# EAGLE design ardunio-physics-board-v1 (EAGLE 9.6.2)
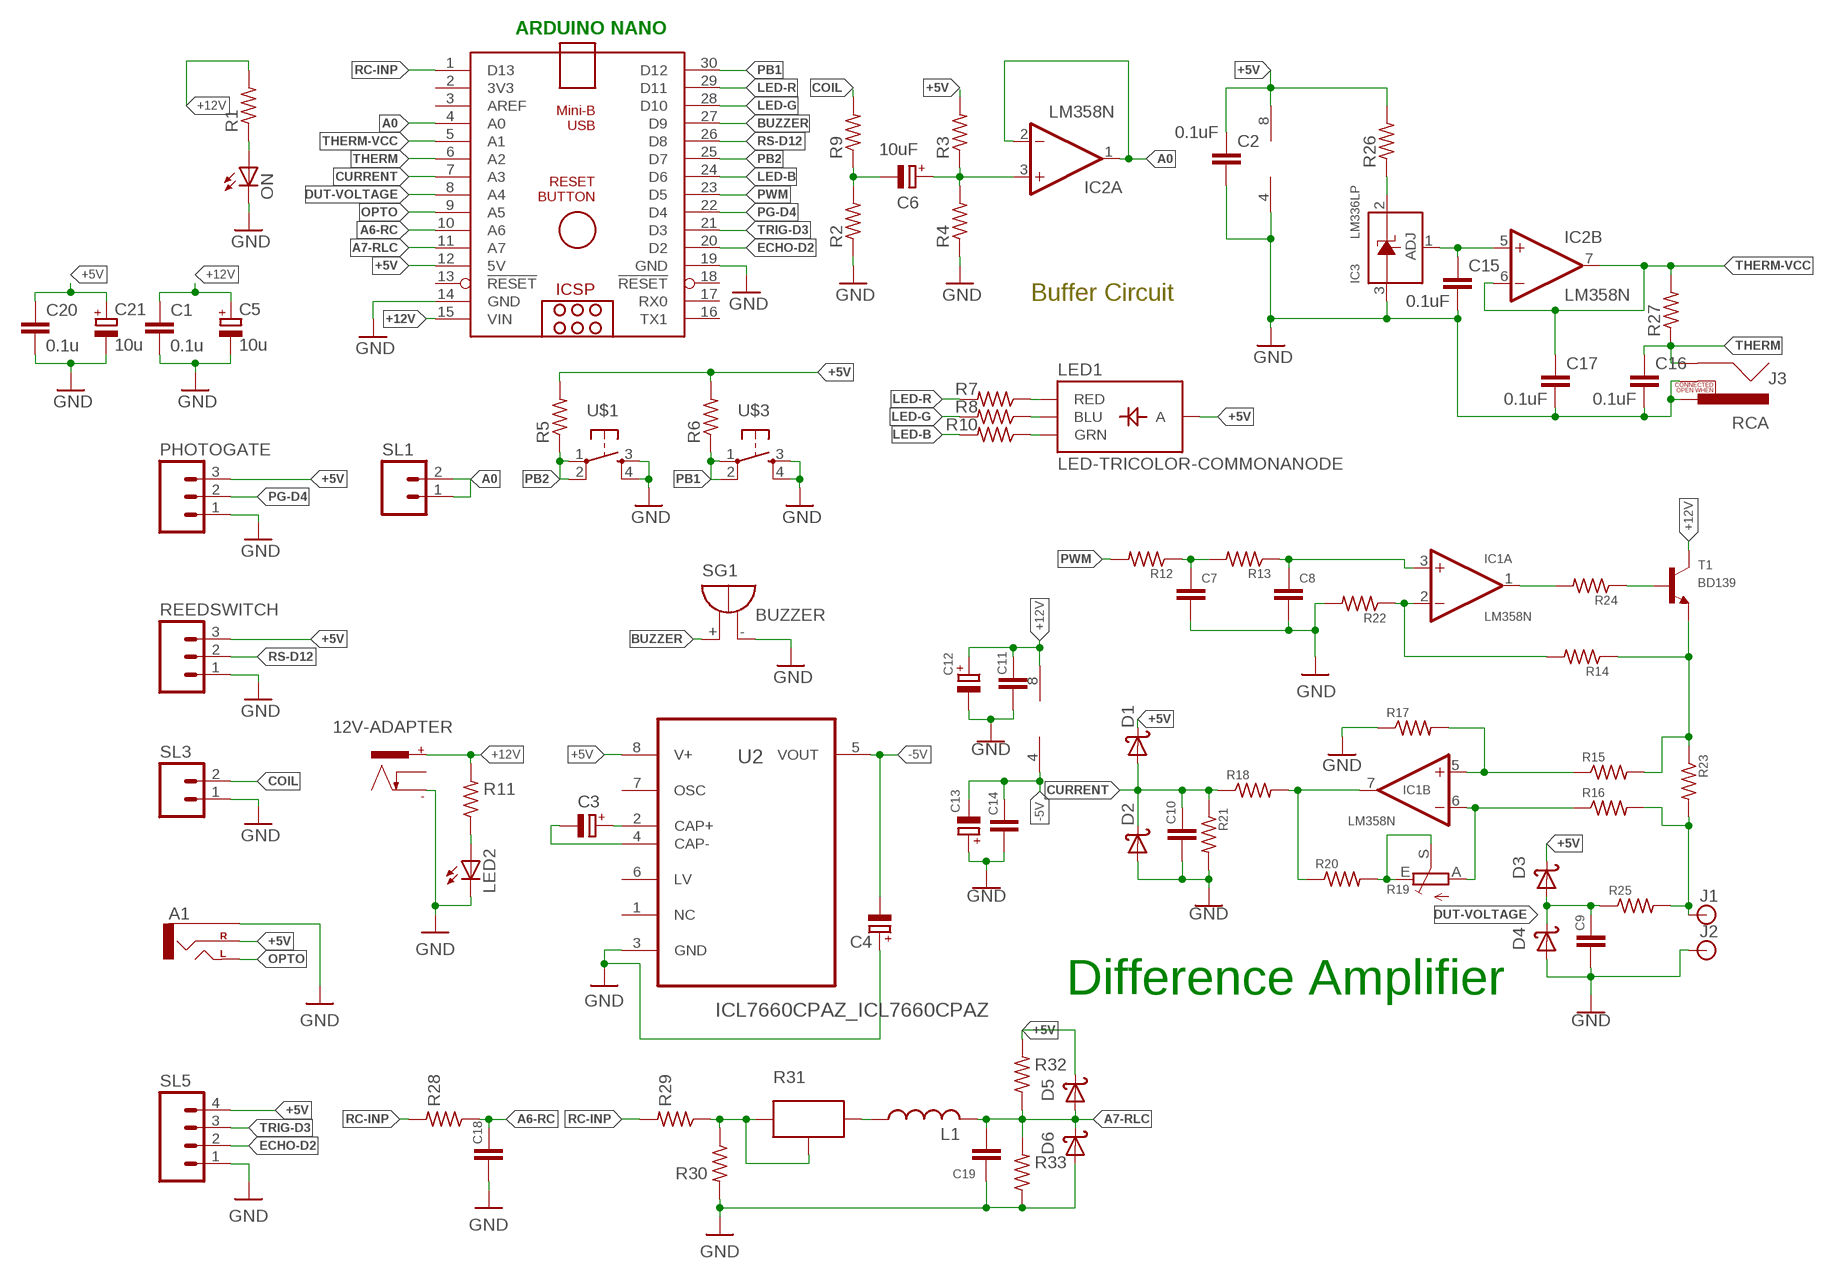
[diagram p0: schematic, sheet 1]

## Parts
12V-ADAPTER  POWER_CON  [NEB21R]
A1  CEDT_JANUARY_2015_V5_AUDIO-JACKPTH  [CEDT_JANUARY_2015_V5_AUDIO-JACK]
ARDUINO_NANO1  ARDUINO_NANO  [ARDUINO_NANO]
C1  0.1u  C-EU025-024X044  [C025-024X044]
C2  0.1uF  C-EU025-025X050  [C025-025X050]
C3  CPOL-EUTT2D5  [TT2D5]
C4  CPOL-EUTT2D5  [TT2D5]
C5  10u  CPOL-EUE2.5-5  [E2,5-5]
C6  10uF  CPOL-EUE2.5-6  [E2,5-6]
C7  C-EU025-025X050  [C025-025X050]
C8  C-EU025-025X050  [C025-025X050]
C9  C-EU025-025X050  [C025-025X050]
C10  C-EU025-025X050  [C025-025X050]
C11  C-EU025-025X050  [C025-025X050]
C12  CPOL-EUTT2D5  [TT2D5]
C13  CPOL-EUTT2D5  [TT2D5]
C14  C-EU025-025X050  [C025-025X050]
C15  0.1uF  C-EU025-025X050  [C025-025X050]
C16  0.1uF  C-EU025-025X050  [C025-025X050]
C17  0.1uF  C-EU025-025X050  [C025-025X050]
C18  C-EU025-025X050  [C025-025X050]
C19  C-EU025-025X050  [C025-025X050]
C20  0.1u  C-EU025-024X044  [C025-024X044]
C21  10u  CPOL-EUE2.5-5  [E2,5-5]
D1  1N5819  [DO41-10]
D2  1N5819  [DO41-10]
D3  1N5819  [DO41-10]
D4  1N5819  [DO41-10]
D5  1N5819  [DO41-10]
D6  1N5819  [DO41-10]
IC1  LM358N  [DIL08]
IC2  LM358N  [DIL08]
IC3  LM336LP  [TO92]
J1  BANANA_CONN  [BANANA_CONN]
J2  BANANA_CONN  [BANANA_CONN]
J3  RCA  [RCA]
L1  L-US6000-XXX-RC  [6000-XXXX-RC]
LED1  LED-TRICOLOR-COMMONANODE  [LED-TRICOLOR-THROUGHHOLE]
LED2  LED3MM  [LED3MM]
ON  LED3MM  [LED3MM]
PHOTOGATE  M03  [03P]
R1  R-US_0204/7  [0204/7]
R2  R-US_0204/7  [0204/7]
R3  R-US_0204/7  [0204/7]
R4  R-US_0204/7  [0204/7]
R5  R-US_0204/7  [0204/7]
R6  R-US_0204/7  [0204/7]
R7  R-US_0204/7  [0204/7]
R8  R-US_0204/7  [0204/7]
R9  R-US_0204/7  [0204/7]
R10  R-US_0204/7  [0204/7]
R11  R-US_0204/7  [0204/7]
R12  R-US_0204/7  [0204/7]
R13  R-US_0204/7  [0204/7]
R14  R-US_0204/7  [0204/7]
R15  R-US_0204/7  [0204/7]
R16  R-US_0204/7  [0204/7]
R17  R-US_0204/7  [0204/7]
R18  R-US_0204/7  [0204/7]
R19  TRIM_EU-RJ9W  [RJ9W]
R20  R-US_0204/7  [0204/7]
R21  R-US_0204/7  [0204/7]
R22  R-US_0204/7  [0204/7]
R23  R-US_0207/10  [0207/10]
R24  R-US_0204/7  [0204/7]
R25  R-US_0204/7  [0204/7]
R26  R-US_0204/7  [0204/7]
R27  R-US_0204/7  [0204/7]
R28  R-US_0204/7  [0204/7]
R29  R-US_0204/7  [0204/7]
R30  R-US_0204/7  [0204/7]
R31  POTNORMAL  [RJ9W]
R32  R-US_0204/7  [0204/7]
R33  R-US_0204/7  [0204/7]
REEDSWITCH  M03  [03P]
SG1  BUZZER  [F/TMB]
SL1  M02  [02P]
SL3  M02  [02P]
SL5  M04  [04P]
T1  BD139  [TO126]
U2  ICL7660CPAZ_ICL7660CPAZ  [ICL7660CPAZ_DIP254P762X533-8]
U$1  OMRON_SWITCH_40-XX  [B3F-40XX]
U$3  OMRON_SWITCH_40-XX  [B3F-40XX]

## Nets
+5V: A1.RING(RIGHT) ARDUINO_NANO1.12(5V) C2.1 C20.1 C21.+ D1.C D3.C D5.C IC2.8(P:V+) LED1.ANODE(A) PHOTOGATE.3 R3.2 R5.2 R6.2 R26.2 R32.2 REEDSWITCH.3 SL5.4 U2.8(V+)
+12V: 12V-ADAPTER.+ ARDUINO_NANO1.15(VIN) C1.1 C5.+ C11.1 C12.+ IC1.8(P:V+) R1.2 R11.2 T1.2(C)
-5V: C4.- C13.- C14.1 IC1.4(P:V-) U2.5(VOUT)
A0: ARDUINO_NANO1.4(A0) IC2.1(A:OUT) IC2.2(A:-IN) SL1.1 SL1.2
A6-RC: ARDUINO_NANO1.10(A6) C18.1 R28.1
A7-RLC: ARDUINO_NANO1.11(A7) C19.1 D5.A D6.C L1.2 R32.1 R33.2
BUZZER: ARDUINO_NANO1.27(D9) SG1.+
CLAMP_SIGNAL: C6.+ IC2.3(A:+IN) R3.1 R4.2
COIL: R9.2 SL3.2
CURRENT: ARDUINO_NANO1.7(A3) C10.1 D1.A D2.C R18.1 R21.1
DUT-VOLTAGE: ARDUINO_NANO1.8(A4) C9.1 D3.A D4.C R25.1
ECHO-D2: ARDUINO_NANO1.20(D2) SL5.2
GND: 12V-ADAPTER.- A1.SLEEVE ARDUINO_NANO1.14(GND) ARDUINO_NANO1.19(GND) C1.2 C2.2 C4.+ C5.- C7.2 C8.2 C9.2 C10.2 C11.2 C12.- C13.+ C14.2 C15.2 C16.2 C17.2 C18.2 C19.2 C20.2 C21.- D2.A D4.A D6.A IC2.4(P:V-) IC3.3(A) J2.P$1 J3.PIN J3.SWITCH LED2.K(C) ON.K(C) PHOTOGATE.1 R2.1 R4.1 R17.1 R21.2 R22.2 R30.2 R33.1 REEDSWITCH.1 SG1.- SL3.1 SL5.1 U2.3(GND) U$1.3(S) U$1.4(S1) U$3.3(S) U$3.4(S1)
LED-B: ARDUINO_NANO1.24(D6) R10.2
LED-G: ARDUINO_NANO1.28(D10) R8.2
LED-R: ARDUINO_NANO1.29(D11) R7.2
N$1: C6.- R2.2 R9.1
N$2: LED1.RED R7.1
N$3: LED1.BLU R8.1
N$4: LED1.GRN R10.1
N$5: IC1.1(A:OUT) R24.2
N$6: IC3.2(C) R26.1
N$7: C15.1 IC2.5(B:+IN) IC3.1(ADJ)
N$9: C3.+ U2.2(CAP+)
N$10: C3.- U2.4(CAP-)
N$11: C7.1 R12.1 R13.2
N$12: LED2.A R11.1
N$13: ON.A R1.1
N$14: R24.1 T1.3(B)
N$15: C8.1 IC1.3(A:+IN) R13.1
N$16: IC1.2(A:-IN) R14.2 R22.1
N$17: IC1.5(B:+IN) R15.1 R17.2
N$18: IC1.6(B:-IN) R16.1 R19.A
N$19: R14.1 R15.2 R23.1 T1.1(E)
N$20: R19.E R19.S R20.2
N$21: IC1.7(B:OUT) R18.2 R20.1
N$22: J1.P$1 R16.2 R23.2 R25.2
N$24: R29.1 R30.1 R31.E R31.S
N$25: L1.1 R31.A
OPTO: A1.TIP(LEFT) ARDUINO_NANO1.9(A5)
PB1: ARDUINO_NANO1.30(D12) R6.1 U$3.1(P) U$3.2(P1)
PB2: ARDUINO_NANO1.25(D7) R5.1 U$1.1(P) U$1.2(P1)
PG-D4: ARDUINO_NANO1.22(D4) PHOTOGATE.2
PWM: ARDUINO_NANO1.23(D5) R12.2
RC-INP: ARDUINO_NANO1.1(D13) R28.2 R29.2
RS-D12: ARDUINO_NANO1.26(D8) REEDSWITCH.2
THERM: ARDUINO_NANO1.6(A2) C16.1 J3.SHELL R27.1
THERM-VCC: ARDUINO_NANO1.5(A1) C17.1 IC2.6(B:-IN) IC2.7(B:OUT) R27.2
TRIG-D3: ARDUINO_NANO1.21(D3) SL5.3
Unconnected: 12V-ADAPTER.C ARDUINO_NANO1.2(3V3) ARDUINO_NANO1.3(AREF) ARDUINO_NANO1.13(!RESET) ARDUINO_NANO1.16(TX1) ARDUINO_NANO1.17(RX0) ARDUINO_NANO1.18(!RESET) U2.1(NC) U2.6(LV) U2.7(OSC)

## Notes on the sheet
- ARDUINO NANO
- Buffer Circuit
- Difference Amplifier

## Library data of the parts
12V-ADAPTER = CEDT_JANUARY_2015_v5:POWER_CON: DC Power Connector
A1 = aux-connector:CEDT_JANUARY_2015_V5_AUDIO-JACK: 3.5mm Audio Jack Simple 3.5mm common PCB mount audio jack. SKU: PRT-08032
ARDUINO_NANO1 = ArduinoNanoV30:ARDUINO_NANO: Arduino Nano V3.0 Overview: The Arduino Nano is a small, complete, and breadboard-friendly board based on the ATmega328 (Arduino Nano 3.x) or ATmega168 (Arduino Nano 2.x). It has more or less the same functionality of the Arduino Duemilanove, but in a different package. It lacks only a DC power jack, and works with a Mini-B USB cable instead of a standard one. The Nano was designed and is being produced by Gravitech. Specifications: Microcontroller Atmel ATmega168 or ATmega328 Operating Voltage (logic level) 5 V Input Voltage (recommended) 7-12 V Input Voltage (limits) 6-20 V Digital I/O Pins 14 (of which 6 provide PWM output) Analog Input Pins 8 DC Current per I/O Pin 40 mA Flash Memory 16 KB (ATmega168) or 32 KB (ATmega328) of which 2 KB used by bootloader SRAM 1 KB (ATmega168) or 2 KB (ATmega328) EEPROM 512 bytes (ATmega168) or 1 KB (ATmega328) Clock Speed 16 MHz Dimensions 0.73" x 1.70" Length 45 mm Width 18 mm Weigth 5 g Power: The Arduino Nano can be powered via the Mini-B USB connection, 6-20V unregulated external power supply (pin 30), or 5V regulated external power supply (pin 27). The power source is automatically selected to the highest voltage source. Memory: The ATmega168 has 16 KB of flash memory for storing code (of which 2 KB is used for the bootloader); the ATmega328 has 32 KB, (also with 2 KB used for the bootloader). The ATmega168 has 1 KB of SRAM and 512 bytes of EEPROM (which can be read and written with the EEPROM library); the ATmega328 has 2 KB of SRAM and 1 KB of EEPROM. Input and Output: Each of the 14 digital pins on the Nano can be used as an input or output, using pinMode(), digitalWrite(), and digitalRead() functions. They operate at 5 volts. Each pin can provide or receive a maximum of 40 mA and has an internal pull-up resistor (disconnected by default) of 20-50 kOhms. In addition, some pins have specialized functions. Visit Arduino - ArduinoBoardNano <https://www.arduino.cc/en/Main/ArduinoBoardNano>
C1 C7-C11 C14 C18-C20 = rcl:C-EU: CAPACITOR, European symbol; SPICEPREFIX: C
C2 C15-C17 = Arduino_Hackathon_v5:C-EU: CAPACITOR, European symbol
C3-C6 C12 C13 C21 = rcl:CPOL-EU: POLARIZED CAPACITOR, European symbol; SPICEPREFIX: C
D1-D6 = CEDT_JANUARY_2015_v5:1N5819: DIODE general purpose rectifier, 1 A
IC1 IC2 = CEDT_JANUARY_2015_v5:LM358: OP AMP also LM158; LM258; LM2904 Source: http://cache.national.com/ds/LM/LM158.pdf
IC3 = linear:LM336: 2.5-V INTEGRATED REFERENCE CIRCUITS LM236 Source: http://focus.ti.com/lit/ds/symlink/lm336-2.5.pdf
J1 J2 = SparkFun-Connectors:BANANA_CONN: Through-hole Banana Jack Basic PTH connection for banana jack plugs SparkFun Products: Multimeter Kit <https://www.sparkfun.com/products/retired/10956> Banana to Alligator Cable <https://www.sparkfun.com/products/retired/509> Banana to Alligator Coax Cable <https://www.sparkfun.com/products/retired/508> Banana to Banana Cable <https://www.sparkfun.com/products/retired/507> Banana to IC Hook Cables <https://www.sparkfun.com/products/retired/506>
J3 = SparkFun-Connectors:RCA: RCA Jack connector This is a right angle RCA jack connecotr. Commonly used for video or audio. Here is the connector we sell at SparkFun: RCA Jack <https://www.sparkfun.com/products/8631> (PRT-08631) Datasheet <http://www.sparkfun.com/datasheets/Prototyping/Connectors/RCA-Jack.pdf> It is not used on any active designs, however it was used on a couple retired products: RCA Jack Breakout [RETIRED] <https://www.sparkfun.com/products/8826> (PRT-08826) SparkFun On Screen Display Breakout - MAX7456 [RETIRED] <https://www.sparkfun.com/products/9168> (BOB-09168) You may also be interested in a cable: RCA Video Cable - 6' <https://www.sparkfun.com/products/11573> (CAB-11573); PROD_ID: CONN-09081; SF_ID: PRT-08631
L1 = rcl:L-US: INDUCTOR, American symbol; SPICEPREFIX: L
LED1 = CEDT_JANUARY_2015_v5:LED-TRICOLOR-COMMONANODE
LED2 = CEDT_JANUARY_2015_v5:LED
ON = CEDT:LED; OC_FARNELL: unknown
PHOTOGATE REEDSWITCH = con-amp-quick:M03: AMP QUICK CONNECTOR; OC_FARNELL: unknown; OC_NEWARK: unknown
R1-R18 R20-R30 R32 R33 = rcl:R-US_: RESISTOR, American symbol; SPICEPREFIX: R
R19 = pot:TRIM_EU-: POTENTIOMETER
R31 = CEDT_JANUARY_2015_v5:POT
SG1 = CEDT_JANUARY_2015_v5:BUZZER: BUZZER Source: Buerklin; OC_FARNELL: unknown; OC_NEWARK: unknown
SL1 SL3 = con-amp-quick:M02: AMP QUICK CONNECTOR; OC_FARNELL: unknown; OC_NEWARK: unknown
SL5 = con-amp-quick:M04: AMP QUICK CONNECTOR; OC_FARNELL: unknown; OC_NEWARK: unknown
T1 = transistor:BD139: NPN TRANSISTOR
U2 = CurveTracer_V6:ICL7660CPAZ_ICL7660CPAZ: CMOS Voltage Converters Check prices <https://pricing.snapeda.com/parts/ICL7660CPAZ/Renesas%20Electronics/view-part?ref=eda>; AVAILABILITY: In Stock; DESCRIPTION: Charge Pump Switching Regulator IC Positive or Negative Fixed -Vin, 2Vin 1 Output 45mA 8-DIP (0.300, 7.62mm); MF: Renesas Electronics; MP: ICL7660CPAZ; PACKAGE: DIP-8 Intersil; PRICE: None
U$1 U$3 = CEDT_JANUARY_2015_v5:OMRON_SWITCH

## Net classes
0 default: width 0.508 mm
1 POWER: width 0.406 mm

## Board
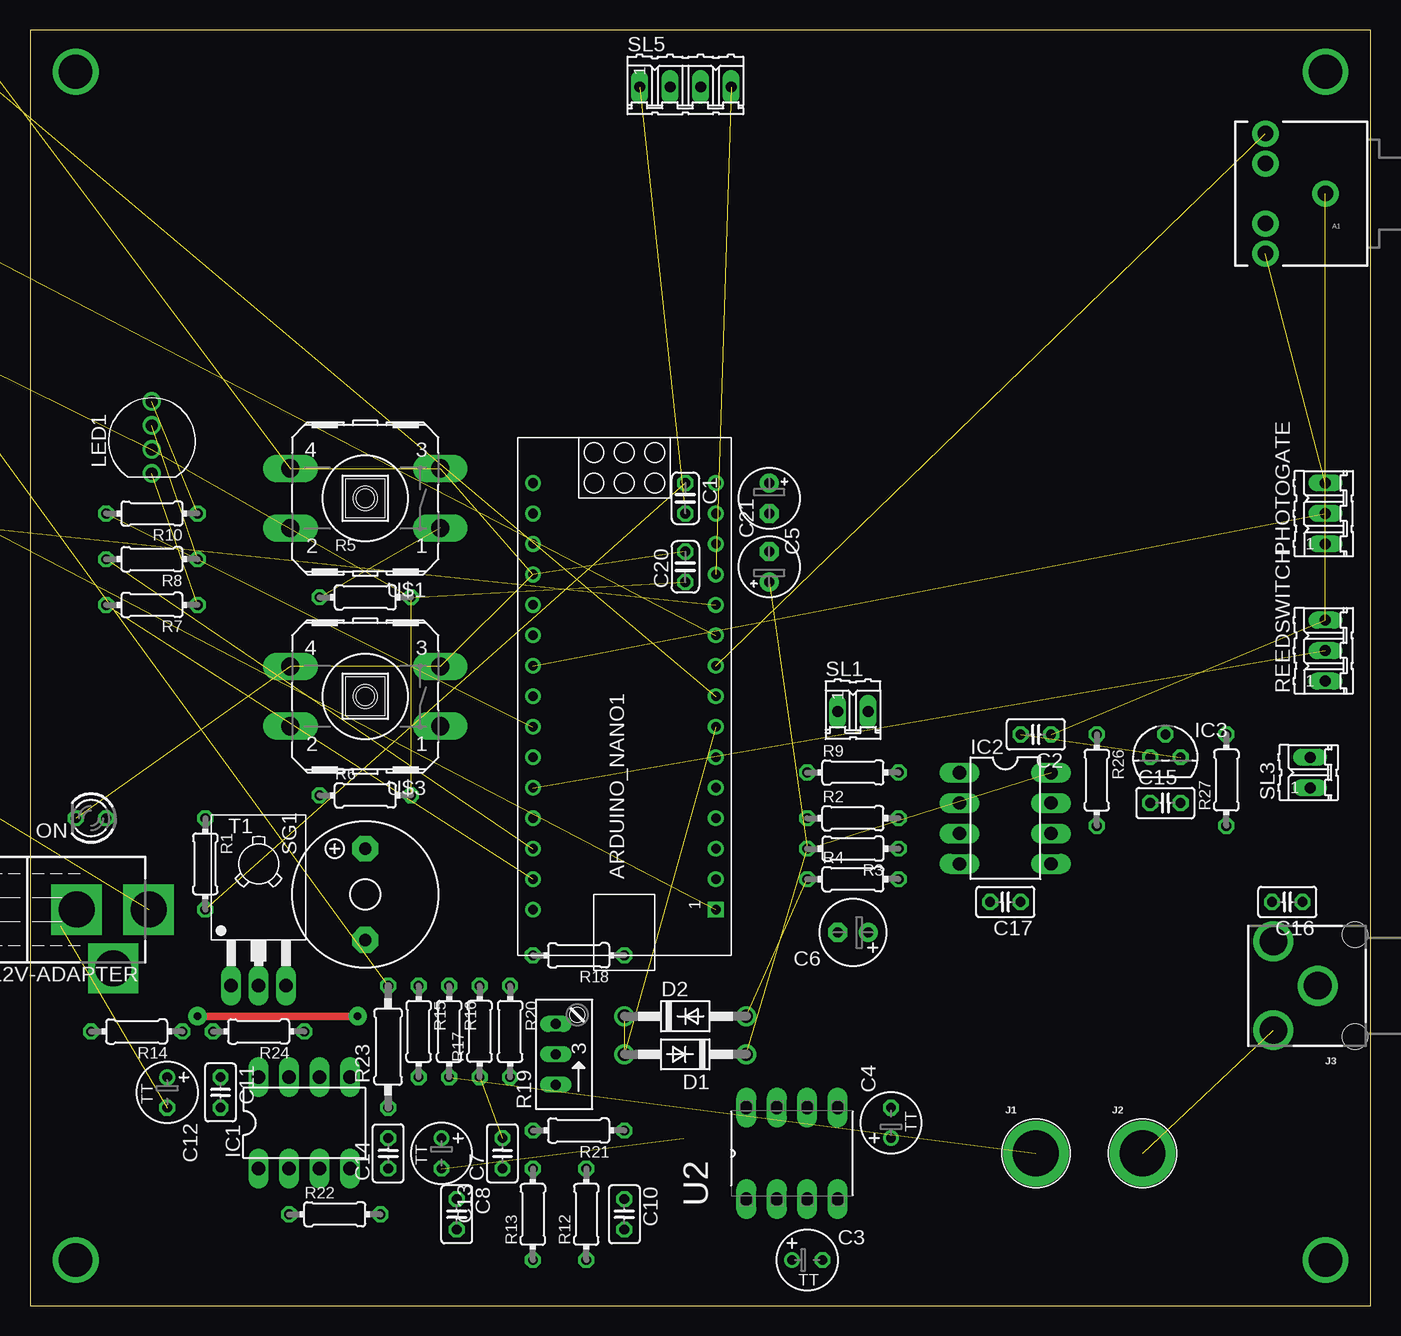
[diagram p1: board, top side]
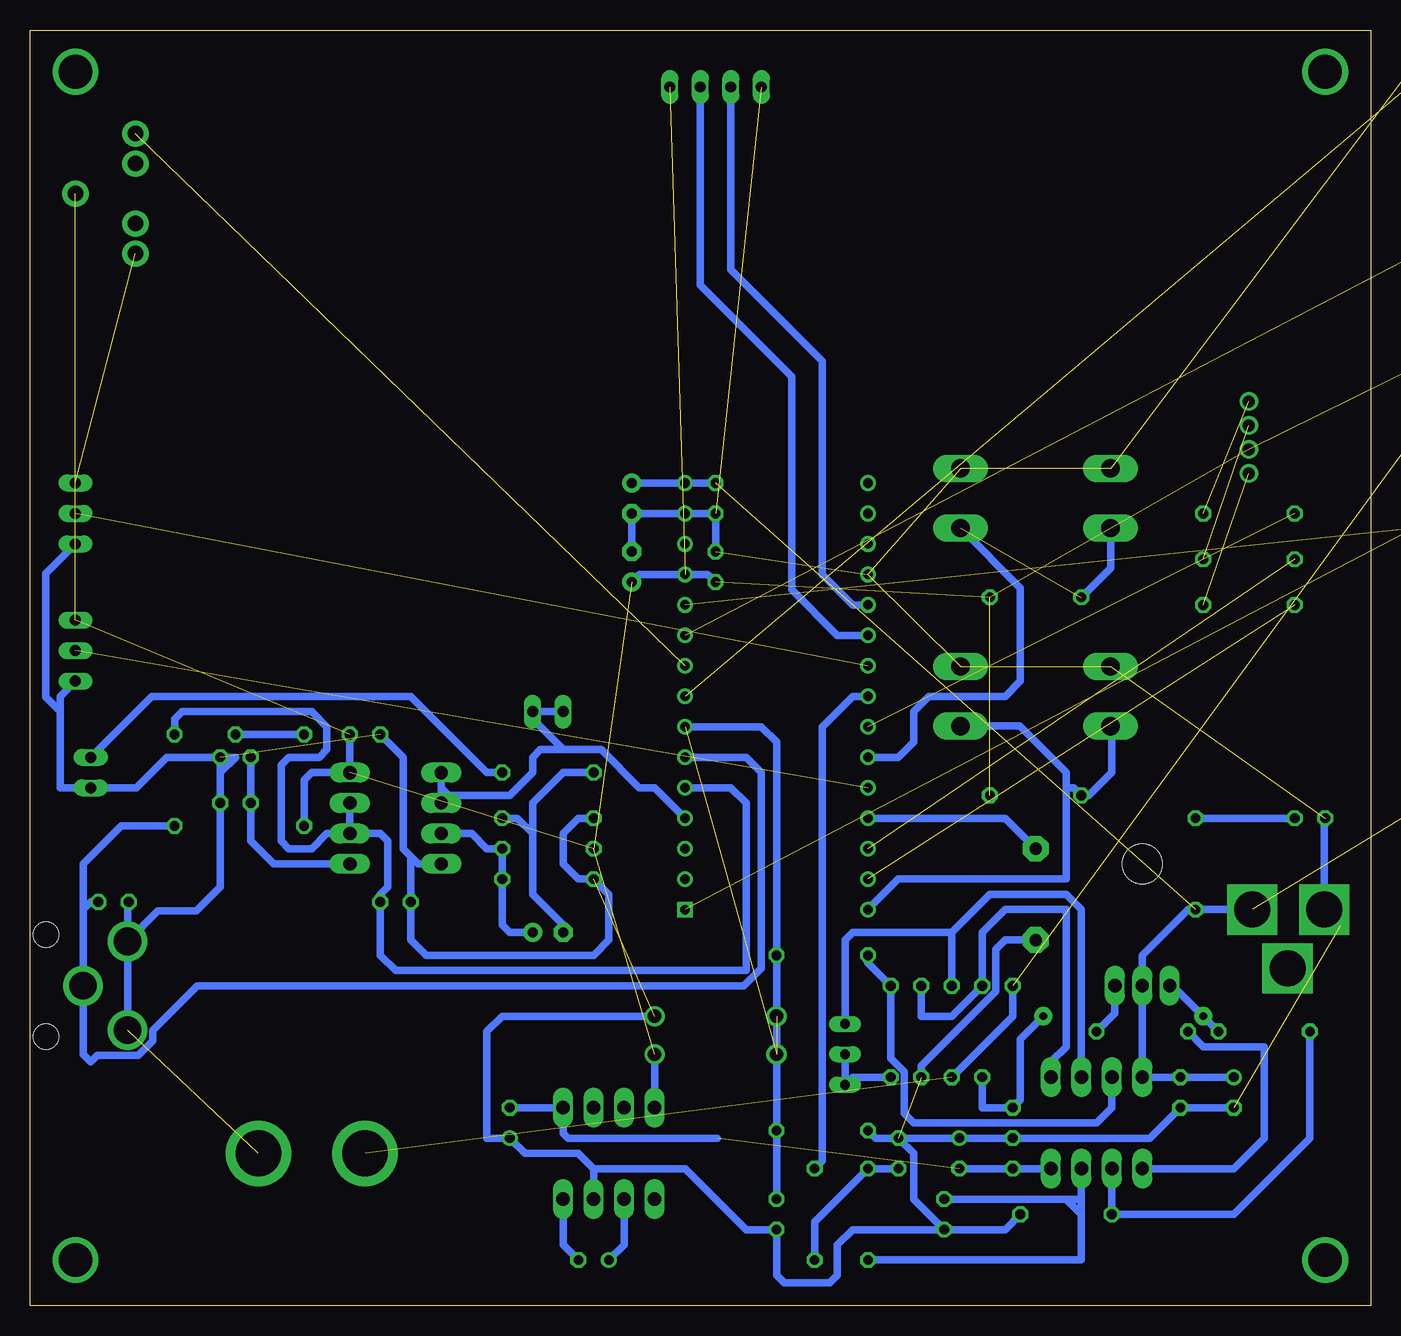
[diagram p2: board, bottom side, seen from below]

Size 111.74 x 106.35 mm. Coordinates in mm from the lower left corner, seen from the top.
Outline: 0,0 111.74,0 111.74,106.35 0,106.35 0,0
Copper layers (1*16): Top 0.035mm / dielectric 1.5mm / Bottom 0.035mm
Design rules "default": minimum track width 6mil, minimum drill 0.35mm, track to track 6mil, track to pad 6mil, pad to pad 6mil, via to via 6mil, smd to smd 6mil, copper to edge 40mil, drill to drill 6mil, minimum pad ring 10mil, minimum via ring 8mil, stop-mask expansion 4mil, vias tented up to drill 0mil, thermal gap 10mil

### Footprints (pad centres in the part's own frame; a part is rotated, then mirrored left to right if it is on the bottom)
NEB21R = drill 3 pad 4.2 square: + 0,3.54; - 0,-2.46; C 4.9,0.59
CEDT_JANUARY_2015_V5_AUDIO-JACK = drill 1.3 pad 2.184: RING 5,5; RSH 5,2.5; SLEEVE 0,0; TIP 5,-5; TSH 5,-2.5
ARDUINO_NANO = drill 0.8 square: 1 -20.32,-7.62 | drill 0.8: 2 -17.78,-7.62; 3 -15.24,-7.62; 4 -12.7,-7.62; 5 -10.16,-7.62; 6 -7.62,-7.62; 7 -5.08,-7.62; 8 -2.54,-7.62; 9 0,-7.62; 10 2.54,-7.62; 11 5.08,-7.62; 12 7.62,-7.62; 13 10.16,-7.62; 14 12.7,-7.62; 15 15.24,-7.62; 16 15.24,7.62; 17 12.7,7.62; 18 10.16,7.62; 19 7.62,7.62; 20 5.08,7.62; 21 2.54,7.62; 22 0,7.62; 23 -2.54,7.62; 24 -5.08,7.62; 25 -7.62,7.62; 26 -10.16,7.62; 27 -12.7,7.62; 28 -15.24,7.62; 29 -17.78,7.62; 30 -20.32,7.62
C025-024X044 = drill 0.813 octagon: 1 -1.27,0; 2 1.27,0
C025-025X050 = drill 0.813 octagon: 1 -1.27,0; 2 1.27,0
TT2D5 = drill 0.813: + -1.27,0 | drill 0.813 octagon: - 1.27,0
E2,5-5 = drill 0.813 pad 1.6: + -1.27,0 | drill 0.813 pad 1.6 octagon: - 1.27,0
E2,5-6 = drill 0.813 pad 1.6: + -1.27,0 | drill 0.813 pad 1.6 octagon: - 1.27,0
DO41-10 = drill 1.118: A 5.08,0; C -5.08,0
DIL08 = drill 1.118 long: 1 -3.81,-3.81; 2 -1.27,-3.81; 3 1.27,-3.81; 4 3.81,-3.81; 5 3.81,3.81; 6 1.27,3.81; 7 -1.27,3.81; 8 -3.81,3.81
TO92 = drill 0.813 octagon: 1 -1.27,0; 2 0,1.905; 3 1.27,0
BANANA_CONN = drill 3.81 pad 5.461: P$1 0,0
RCA = drill 2.3: PIN 3.7,3.7; SHELL 0,0; SWITCH 3.7,-3.7 | hole 2.1: -3.1,4.25; -3.1,-4.25
6000-XXXX-RC = drill 0.9 pad 1.422: 1 -2.5,0; 2 2.5,0
LED-TRICOLOR-THROUGHHOLE = drill 1: ANODE -1,0; BLU 1,0; GRN 3,0; RED -3,0
LED3MM = drill 0.813 octagon: A -1.27,0; K 1.27,0
03P = drill 0.914 long: 1 -2.54,0; 2 0,0; 3 2.54,0
0204/7 = drill 0.813 octagon: 1 -3.81,0; 2 3.81,0
RJ9W = drill 0.813 long: A 2.54,0.635; E -2.54,0.635; S 0,0.635
0207/10 = drill 0.813 octagon: 1 -5.08,0; 2 5.08,0
RJ9W' = drill 1.27 long: A 3.81,8.255; E -3.81,8.255; S 0,8.255 | drill 2.286 pad 3.658: P$1 0,-8.382 | drill 2.54 pad 5.08: P$3 6.35,-1.905; P$4 -6.35,-1.905
F/TMB = drill 1.016 pad 2.159 octagon: + 3.81,0; - -3.81,0
02P = drill 0.914 long: 1 -1.27,0; 2 1.27,0
04P = drill 0.914 long: 1 -3.81,0; 2 -1.27,0; 3 1.27,0; 4 3.81,0
TO126 = drill 1.118 long: 1 -2.286,-5.08; 2 0,-5.08; 3 2.286,-5.08 | hole 3.302: 0,5.08
ICL7660CPAZ_DIP254P762X533-8 = drill 1.118 long: 1 -7.62,7.62; 2 -7.62,5.08; 3 -7.62,2.54; 4 -7.62,0; 5 0,0; 6 0,2.54; 7 0,5.08; 8 0,7.62
B3F-40XX = drill 1.524 long: 1 -6.248,2.489; 2 6.248,2.489; 3 -6.248,-2.489; 4 6.248,-2.489

### Placement (x,y rotation side)
12V-ADAPTER  6.35,33.02 270 top
A1  107.95,92.71 180 top
ARDUINO_NANO1  49.53,53.34 90 top
C1  54.61,67.31 270 top
C2  83.82,47.62 180 top
C3  64.77,3.81 0 top
C4  71.75,15.24 90 top
C5  61.59,67.31 270 top
C6  68.58,31.12 180 top
C7  39.37,12.7 90 top
C8  35.56,7.62 270 top
C9  -6.35,105.41 0 top  (outside the outline)
C10  49.53,7.62 270 top
C11  15.88,17.78 270 top
C12  11.43,17.78 270 top
C13  34.29,12.7 270 top
C14  29.84,12.7 90 top
C15  94.61,41.91 0 top
C16  104.78,33.66 180 top
C17  81.28,33.66 180 top
C18  -31.75,102.87 0 top  (outside the outline)
C19  -38.1,102.87 0 top  (outside the outline)
C20  54.61,61.59 90 top
C21  61.59,61.59 90 top
D1  54.61,20.96 180 top
D2  54.61,24.13 0 top
D3  -22.86,90.17 0 top  (outside the outline)
D4  -35.56,90.17 0 top  (outside the outline)
D5  -48.26,90.17 0 top  (outside the outline)
D6  -22.86,48.26 0 top  (outside the outline)
IC1  22.86,15.24 0 top
IC2  81.28,40.64 270 top
IC3  94.61,45.72 0 top
J1  83.82,12.7 0 top
J2  92.71,12.7 0 top
J3  107.31,26.67 180 top
L1  -40.64,29.21 0 top  (outside the outline)
LED1  10.16,72.39 90 top
LED2  -25.4,62.23 0 top  (outside the outline)
ON  5.08,40.64 180 top
PHOTOGATE  107.95,66.04 90 top
R1  14.61,36.83 270 top
R2  68.58,40.64 0 top
R3  68.58,38.1 180 top
R4  68.58,35.56 0 top
R5  27.94,59.05 0 top
R6  27.94,42.55 0 top
R7  10.16,58.42 180 top
R8  10.16,62.23 180 top
R9  68.58,44.45 0 top
R10  10.16,66.04 180 top
R11  -35.56,58.42 0 top  (outside the outline)
R12  46.35,7.62 90 top
R13  41.91,7.62 90 top
R14  8.89,22.86 180 top
R15  32.38,22.86 270 top
R16  34.92,22.86 270 top
R17  37.47,22.86 90 top
R18  45.72,29.21 180 top
R19  44.45,20.96 90 top
R20  40.01,22.86 270 top
R21  45.72,14.61 180 top
R22  25.4,7.62 0 top
R23  29.84,21.59 90 top
R24  19.05,22.86 180 top
R25  -10.16,76.2 0 top  (outside the outline)
R26  88.9,43.81 270 top
R27  99.69,43.81 90 top
R28  -29.21,76.2 0 top  (outside the outline)
R29  -39.37,76.2 0 top  (outside the outline)
R30  -25.4,68.58 0 top  (outside the outline)
R31  [RJ9W']  -22.86,25.4 0 top  (outside the outline)
R32  -35.56,68.58 0 top  (outside the outline)
R33  -45.72,68.58 0 top  (outside the outline)
REEDSWITCH  107.95,54.61 90 top
SG1  27.94,34.29 90 top
SL1  68.58,49.53 0 top
SL3  106.68,44.45 90 top
SL5  54.61,101.6 0 top
T1  19.05,31.75 0 top
U2  67.31,16.51 90 top
U$1  27.94,67.31 180 top
U$3  27.94,50.8 180 top

### Tracks (layer width: path | path; a pad name or v marks a point on that pad's centre or on a via)
+5V  (13 unrouted)
  Bottom 0.61: C2.1 IC2.8 88.27,44.45 88.9,43.81 R26.2 | C20.1 55.24,60.96 ARDUINO_NANO1.12 60.96,60.96 C21.+ | D1.C U2.8
+12V  (2 unrouted)
  Bottom 0.61: C1.1 ARDUINO_NANO1.15 C5.+ | 12V-ADAPTER.+ R1.2 15.24,33.02 19.05,29.21 T1.2 IC1.8 C11.1 C12.+
-5V  (1 unrouted)
  Bottom 0.61: IC1.4 C14.1 C13.- | C4.- U2.5 67.31,14.38 66.9,13.97 54.48,13.97
A0
  Bottom 0.61: IC2.1 77.47,43.18 | 77.47,43.18 IC2.2 | ARDUINO_NANO1.4 59.69,43.18 60.96,43.18 64.14,46.35 67.31,46.35 | 67.31,46.35 69.22,46.35 69.85,45.72 69.85,44.45 71.75,42.55 76.83,42.55 77.47,43.18 | SL1.1 SL1.2 69.85,48.89 67.31,46.35
A6-RC  (2 unrouted)
A7-RLC  (6 unrouted)
BUZZER
  Bottom 0.61: SG1.+ 30.48,40.64 ARDUINO_NANO1.27
CLAMP_SIGNAL
  Bottom 0.61: IC2.3 74.93,39.37 73.66,38.1 R3.1 R4.2 72.39,31.75 71.75,31.12 C6.+
COIL
  Bottom 0.61: SL3.2 101.6,50.8 80.01,50.8 73.66,44.45 R9.2
CURRENT  (2 unrouted)
  Bottom 0.61: ARDUINO_NANO1.7 50.8,48.26 49.53,46.99 R18.1 R21.1 C10.1
DUT-VOLTAGE  (4 unrouted)
ECHO-D2
  Bottom 0.61: SL5.2 53.34,86.36 45.72,78.74 45.72,60.96 43.18,58.42 ARDUINO_NANO1.20
GND  (21 unrouted)
  Bottom 0.61: C2.2 80.64,45.72 80.64,38.1 80.01,37.47 | 80.01,37.47 79.38,36.83 IC2.4 | R2.1 66.04,40.64 67.31,39.37 67.31,36.83 66.04,35.56 R4.1 63.5,34.29 63.5,30.48 64.77,29.21 78.74,29.21 80.01,30.48 C17.2 80.01,37.47 | IC3.3 95.89,44.45 | 95.89,44.45 C15.2 95.89,34.92 97.9,32.91 101.08,32.91 J3.SWITCH | J3.SWITCH J3.PIN | ON.K 3.89,40.56 12V-ADAPTER.- 2.54,31.67 | C16.2 103.61,33.55 J3.SWITCH | 95.89,44.45 94.61,45.72 100.33,45.72 102.87,43.18 SL3.1 109.22,43.18 109.22,49.53 | 109.22,49.53 109.22,50.8 REEDSWITCH.1 | PHOTOGATE.1 110.42,61.03 110.42,50.73 109.22,49.53 | C20.2 C1.2 ARDUINO_NANO1.14 C5.- C21.- | C12.- C11.2 18.41,13.97 C14.2 C13.+ C7.2 | C7.2 38.1,12.7 38.1,8.89 C8.2 | C8.2 30.48,6.35 R22.2 | 64.77,11.43 66.04,12.7 70.48,12.7 C4.+ 73.66,13.97 73.66,22.86 72.39,24.13 D2.A | 64.77,11.43 U2.3 | SG1.- 30.48,30.48 31.27,29.69 31.27,26.21 37.47,20.01 R17.1 | R21.2 41.27,13.97 C7.2 | C8.2 43.18,6.35 44.45,5.08 44.45,2.54 45.09,1.91 48.9,1.91 49.53,2.54 C10.2 52.07,6.35 57.15,11.43 64.77,11.43
LED-B  (1 unrouted)
LED-G  (1 unrouted)
LED-R  (1 unrouted)
N$1
  Bottom 0.61: R2.2 71.12,40.64 69.85,39.37 | 69.85,39.37 69.85,34.29 67.31,31.75 C6.- | R9.1 67.31,44.45 69.85,41.91 69.85,39.37
N$2  (1 unrouted)
N$3  (1 unrouted)
  Bottom 0.61: R8.1 13.97,61.96
N$4  (1 unrouted)
N$5
  Bottom 0.61: R24.2 13.97,21.59 8.89,21.59 8.89,13.97 11.43,11.43 IC1.1
N$6
  Bottom 0.61: R26.1 IC3.2
N$7
  Bottom 0.61: IC3.1 C15.1 93.34,38.73 91.44,36.83 IC2.5
N$8  (via drill 2.79 pad 3.81)
  other vias: 107.95,3.81
N$9
  Bottom 0.61: C3.+ 62.23,5.08 U2.2
N$10
  Bottom 0.61: C3.- 67.31,5.08 U2.4
N$11
  Bottom 0.61: C7.1 R13.2 46.35,6.99 R12.1
N$12  (1 unrouted)
N$13
  Bottom 0.61: ON.A R1.1
N$14
  Bottom 0.61: R24.1 21.34,24.38 T1.3
N$15
  Bottom 0.61: R13.1 24.13,3.81 24.13,7.62 | 24.13,7.62 24.13,8.89 | 24.13,8.89 IC1.3 | C8.1 25.4,8.89 | 25.4,8.89 24.13,8.89 | 24.13,7.62 25.4,8.89
N$16
  Bottom 0.61: IC1.2 R22.1 11.43,7.62 5.08,13.97 R14.2
N$17
  Bottom 0.61: IC1.5 26.67,20.32 25.4,21.59 25.4,33.02 30.48,33.02 32.38,31.12 R15.1 34.92,24.13 37.47,24.13 R17.2
N$18
  Bottom 0.61: R16.1 34.92,31.12 | 34.92,31.12 31.75,34.29 25.4,34.29 24.13,33.02 IC1.6 | R19.A 43.81,30.48 43.18,31.12 34.92,31.12
N$19  (via drill 0.64 pad 1.52)
  Top 0.61: v27.3,24.13 v13.97,24.13
  Bottom 0.61: R14.1 v13.97,24.13 16.51,26.67 T1.1 | R15.2 32.38,16.51 R23.1 29.21,17.14 29.21,22.23 v27.3,24.13
N$20
  Bottom 0.61: R19.S R19.E 43.18,19.05 R20.2
N$21
  Bottom 0.61: IC1.7 21.59,16.51 22.86,15.24 38.1,15.24 38.89,16.03 38.89,19.51 40.01,20.63 R20.1 41.91,28.58 R18.2
N$22  (2 unrouted)
  Bottom 0.61: R16.2 29.84,24.13 R23.2
N$24  (3 unrouted)
N$25  (1 unrouted)
N$26  (via drill 2.79 pad 3.81)
  other vias: 3.81,3.81
N$27  (via drill 2.79 pad 3.81)
  other vias: 3.81,102.87
N$28  (via drill 2.79 pad 3.81)
  other vias: 107.95,102.87
OPTO  (1 unrouted)
PB1
  Bottom 0.61: U$3.2 21.59,48.21 21.59,44.45 23.5,42.55 R6.1 24.77,43.18 25.4,43.18 | U$3.1 29.26,48.31 25.4,44.45 25.4,43.18 | ARDUINO_NANO1.30 39.37,35.56 25.4,35.56 25.4,43.18
PB2  (1 unrouted)
  Bottom 0.61: U$1.2 21.69,61.49 R5.1 | U$1.1 29.21,59.84 29.21,52.07 30.48,50.8 36.83,50.8 38.1,49.53 38.1,46.99 39.37,45.72 ARDUINO_NANO1.25
PG-D4  (1 unrouted)
PWM
  Bottom 0.61: R12.2 45.72,12.07 45.72,48.26 43.18,50.8 ARDUINO_NANO1.23
RC-INP  (2 unrouted)
RS-D12  (1 unrouted)
THERM
  Bottom 0.61: R27.1 104.14,40.01 107.31,36.83 107.31,33.02 | 107.31,33.02 107.31,27.3 106.68,26.67 J3.SHELL 107.31,20.96 106.68,20.32 106.14,20.86 102.74,20.86 101.5,22.09 101.5,22.96 97.79,26.67 52.26,26.67 50.8,28.13 50.8,44.45 52.07,45.72 ARDUINO_NANO1.6 | C16.1 106.68,33.66 107.31,33.02
THERM-VCC
  Bottom 0.61: IC2.7 IC2.6 | IC2.6 82.55,39.37 81.92,38.73 81.92,34.92 82.55,34.29 C17.1 82.55,29.21 81.28,27.94 52.07,27.94 52.07,41.91 53.34,43.18 ARDUINO_NANO1.5 | R27.2 99.69,48.89 99.06,49.53 88.27,49.53 87,48.26 87,46.35 87.63,45.72 90.17,45.72 90.81,45.09 90.81,38.73 90.17,38.1 88.27,38.1 87,39.37 IC2.6
TRIG-D3
  Bottom 0.61: SL5.3 55.88,85.09 48.26,77.47 48.26,59.69 44.45,55.88 ARDUINO_NANO1.21